# Altium schematic sheet SHT_3_EDBG_07349-R5_L10.SchDoc
size B; CompanyName: Microchip Technology Inc.; Organization: Microchip Technology; Address1: 2355 West Chandler Blvd.; Address2: Chandler, AZ  85224; Address4: USA; SheetNumber: 3; SheetTotal: 9; SheetTitle: Embedded Debugger (EDBG); Time: Time
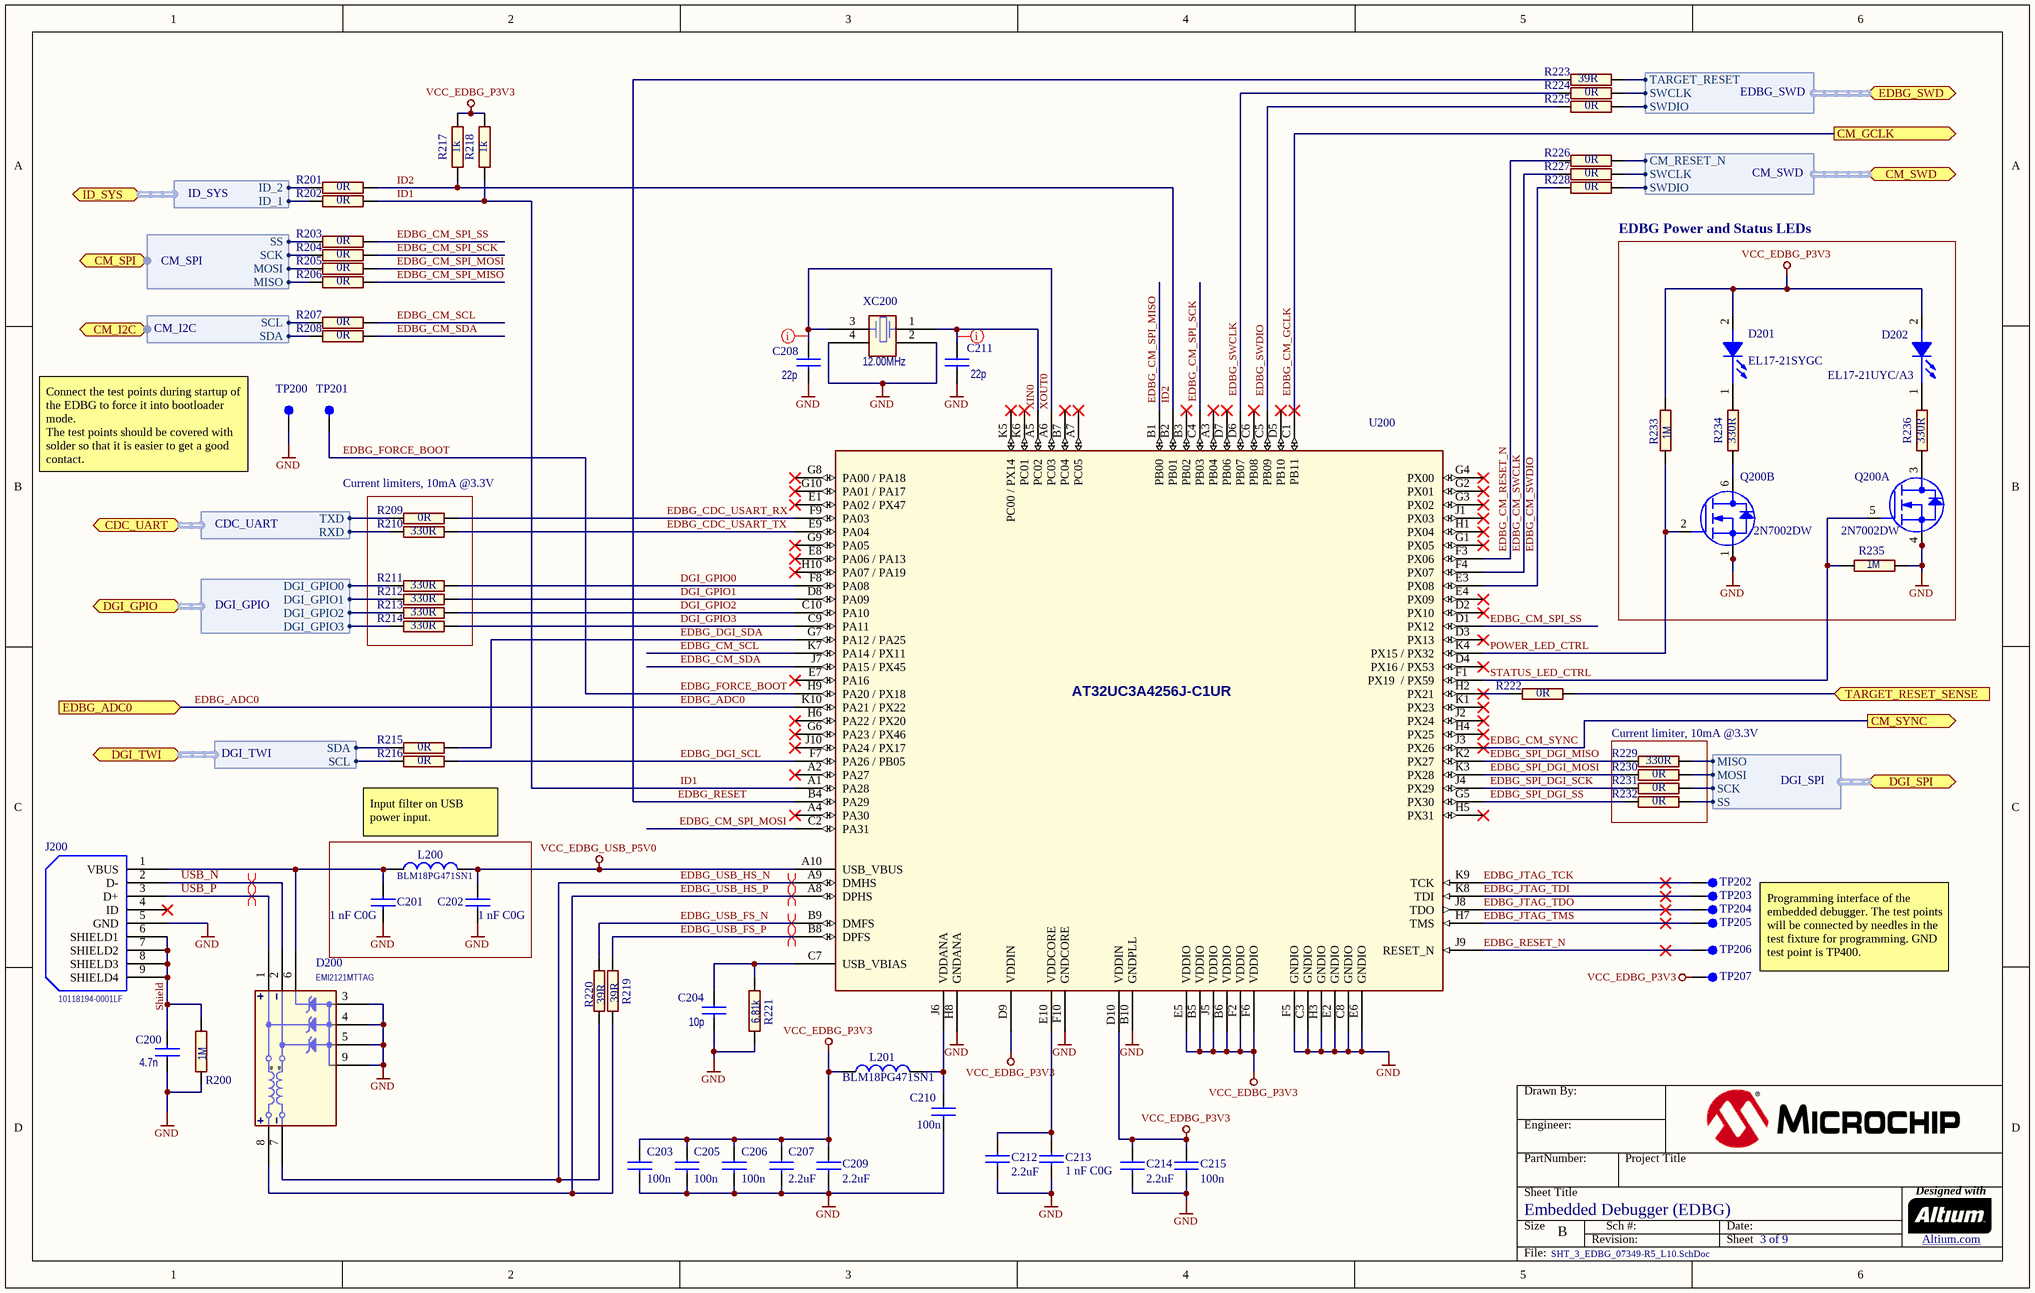
[diagram p0: SHT_3_EDBG_07349-R5_L10.SchDoc]

## Parts
?  (no value)  (graphical)
C200  value 4.7n  [AP1-00053]
C201  value 1 nF C0G  [AP1-00053]
C202  value 1 nF C0G  [AP1-00053]
C203  value 100n  [AP1-00053]
C204  value 10p  [AP1-00053]
C205  value 100n  [AP1-00053]
C206  value 100n  [AP1-00053]
C207  value 2.2uF  [AP1-00053]  (hidden comment: Farnell no: 1288200)
C208  value 22p  [AP1-00053]
C209  value 2.2uF  [AP1-00053]  (hidden comment: Farnell no: 1288200)
C210  value 100n  [AP1-00053]
C211  value 22p  [AP1-00053]
C212  value 2.2uF  [AP1-00053]  (hidden comment: Farnell no: 1288200)
C213  value 1 nF C0G  [AP1-00053]
C214  value 2.2uF  [AP1-00053]
C215  value 100n  [AP1-00053]  (hidden comment: Farnell no: 1288200)
D200  value EMI2121MTTAG  [AP4-00159]  (hidden comment: WDFN8)
D201  value EL17-21SYGC  [AP4-00013]
D202  value EL17-21UYC/A3  [AP4-00013]
J200  MPN: 10118194-0001LF  [AP8-01117]  (hidden comment: USB_AB)
L200  value BLM18PG471SN1  [AP3-00005]
L201  value BLM18PG471SN1  [AP3-00005]
Q200  value 2N7002DW  [AP5-00001]  (hidden comment: Same as 2N7002 but with two MOSFETs in one package)  (parts A,B of 2)
R200  value 1M  [AP2-00011]
R201  value 0R  [AP2-00011]
R202  value 0R  [AP2-00011]
R203  value 0R  [AP2-00011]
R204  value 0R  [AP2-00011]
R205  value 0R  [AP2-00011]
R206  value 0R  [AP2-00011]
R207  value 0R  [AP2-00011]
R208  value 0R  [AP2-00011]
R209  value 0R  [AP2-00000]
R210  value 330R  [AP2-00000]
R211  value 330R  [AP2-00000]
R212  value 330R  [AP2-00000]
R213  value 330R  [AP2-00000]
R214  value 330R  [AP2-00000]
R215  value 0R  [AP2-00000]
R216  value 0R  [AP2-00000]
R217  value 1k  [AP2-00000]
R218  value 1k  [AP2-00000]
R219  value 39R  [AP2-00011]
R220  value 39R  [AP2-00011]
R221  value 6.81k  [AP2-00011]
R222  value 0R  [AP2-00000]
R223  value 39R  [AP2-00011]
R224  value 0R  [AP2-00011]
R225  value 0R  [AP2-00011]
R226  value 0R  [AP2-00000]
R227  value 0R  [AP2-00000]
R228  value 0R  [AP2-00000]
R229  value 330R  [AP2-00000]
R230  value 0R  [AP2-00000]
R231  value 0R  [AP2-00000]
R232  value 0R  [AP2-00000]
R233  value 1M  [AP2-00011]
R234  value 330R  [AP2-00011]
R235  value 1M  [AP2-00011]
R236  value 330R  [AP2-00011]
TP200  (no value)  [AP8-00010]  (no BOM)
TP201  (no value)  [AP8-00010]  (no BOM)
TP202  (no value)  [AP8-00010]  (no BOM)
TP203  (no value)  [AP8-00010]  (no BOM)
TP204  (no value)  [AP8-00010]  (no BOM)
TP205  (no value)  [AP8-00010]  (no BOM)
TP206  (no value)  [AP8-00010]  (no BOM)
TP207  (no value)  [AP8-00010]  (no BOM)
U200  value AT32UC3A4256J-C1UR  [AP6-00206]  (hidden comment: 100 ball VFBGA)
XC200  value 12.00MHz  [AP7-00039]

## Blocks framed on the sheet
EDBG Power and Status LEDs: D201 D202 Q200 R233-R236
Current limiter, 10mA @3.3V: R229-R232

## Ports
CDC_UART (harness CDC_UART), CM_GCLK (out), CM_I2C (harness CM_I2C), CM_SPI (harness CM_SPI), CM_SWD (harness CM_SWD), CM_SYNC (out), DGI_GPIO (harness DGI_GPIO), DGI_SPI (harness DGI_SPI), DGI_TWI (harness DGI_TWI), EDBG_ADC0 (in), EDBG_SWD (harness EDBG_SWD), ID_SYS (harness ID_SYS), TARGET_RESET_SENSE (in)

## Harnesses
CDC_UART: TXD, RXD
DGI_SPI: MISO, MOSI, SCK, SS
DGI_GPIO: DGI_GPIO0, DGI_GPIO1, DGI_GPIO2, DGI_GPIO3
ID_SYS: ID_1, ID_2
DGI_TWI: SCL, SDA
CM_I2C: SCL, SDA
CM_SWD: SWCLK, SWDIO, CM_RESET_N
CM_SPI: MISO, MOSI, SCK, SS
EDBG_SWD: SWCLK, SWDIO, TARGET_RESET

## Nets
GND: C200.1 C201.2 C202.2 C203.2 C204.2 C205.2 C206.2 C207.2 C208.2 C209.2 C210.2 C211.2 C212.2 C213.2 C214.2 C215.2 D200.3(GND) D200.4(GND) D200.5(GND) D200.9(GND) J200.5(GND) Q200.1(S2) Q200.4(S1) R200.1 R221.1 R235.1 TP200.1 U200.B10(GNDPLL) U200.C3(GNDIO) U200.C8(GNDIO) U200.E2(GNDIO) U200.E6(GNDIO) U200.F5(GNDIO) U200.F10(GNDCORE) U200.H3(GNDIO) U200.H8(GNDANA) XC200.2 XC200.4
VCC_EDBG_P3V3: C203.1 C205.1 C206.1 C207.1 C209.1 C214.1 C215.1 D201.2(ANODE) D202.2(ANODE) L201.1 R217.2 R218.2 R233.2 TP207.1 U200.B5(VDDIO) U200.B6(VDDIO) U200.D9(VDDIN) U200.D10(VDDIN) U200.E5(VDDIO) U200.F2(VDDIO) U200.F6(VDDIO) U200.J5(VDDIO)
VCC_EDBG_USB_P5V0: C202.1 L200.2 U200.A10(USB_VBUS)
DGI_GPIO0: R211.2 U200.F8(PA08)
DGI_GPIO1: R212.2 U200.D8(PA09)
DGI_GPIO2: R213.2 U200.C10(PA10)
DGI_GPIO3: R214.2 U200.C9(PA11)
EDBG_ADC0: U200.K10(PA21_/_PX22) ; port EDBG_ADC0
EDBG_CDC_USART_RX: R209.1 U200.F9(PA03)
EDBG_CDC_USART_TX: R210.2 U200.E9(PA04)
EDBG_CM_GCLK: U200.C1(PB11) ; port CM_GCLK
EDBG_CM_RESET_N: R226.2 U200.F3(PX06)
EDBG_CM_SCL: R207.1 U200.K7(PA14_/_PX11)
EDBG_CM_SDA: R208.1 U200.J7(PA15_/_PX45)
EDBG_CM_SPI_MISO: R206.1 U200.B1(PB00)
EDBG_CM_SPI_MOSI: R205.1 U200.C2(PA31)
EDBG_CM_SPI_SCK: R204.1 U200.C4(PB03)
EDBG_CM_SPI_SS: R203.1 U200.D1(PX12)
EDBG_CM_SWCLK: R227.2 U200.F4(PX07)
EDBG_CM_SWDIO: R228.2 U200.E3(PX08)
EDBG_CM_SYNC: U200.J3(PX26) ; port CM_SYNC
EDBG_DGI_SCL: R216.1 U200.F7(PA26_/_PB05)
EDBG_DGI_SDA: R215.1 U200.G7(PA12_/_PA25)
EDBG_FORCE_BOOT: TP201.1 U200.H9(PA20_/_PX18)
EDBG_JTAG_TCK: TP202.1 U200.K9(TCK)
EDBG_JTAG_TDI: TP203.1 U200.K8(TDI)
EDBG_JTAG_TDO: TP204.1 U200.J8(TDO)
EDBG_JTAG_TMS: TP205.1 U200.H7(TMS)
EDBG_RESET: R223.1 U200.B4(PA29)
EDBG_RESET_N: TP206.1 U200.J9(RESET_N)
EDBG_SPI_DGI_MISO: R229.1 U200.K2(PX27)
EDBG_SPI_DGI_MOSI: R230.2 U200.K3(PX28)
EDBG_SPI_DGI_SCK: R231.2 U200.J4(PX29)
EDBG_SPI_DGI_SS: R232.2 U200.G5(PX30)
EDBG_SWCLK: R224.2 U200.D6(PB07)
EDBG_SWDIO: R225.1 U200.C5(PB09)
EDBG_USB_FS_N: R220.2 U200.B9(DMFS)
EDBG_USB_FS_P: R219.2 U200.B8(DPFS)
EDBG_USB_HS_N: D200.7(DIFF2_INT) R220.1 U200.A9(DMHS)
EDBG_USB_HS_P: D200.8(DIFF1_INT) R219.1 U200.A8(DPHS)
ID1: R202.1 R218.1 U200.A1(PA28)
ID2: R201.1 R217.1 U200.B2(PB01)
POWER_LED_CTRL: Q200.2(G2) R233.1 U200.K4(PX15_/_PX32)
Shield: C200.2 J200.6(SHIELD1) J200.7(SHIELD2) J200.8(SHIELD3) J200.9(SHIELD4) R200.2
STATUS_LED_CTRL: Q200.5(G1) R235.2 U200.F1(PX19__/_PX59)
TARGET_RESET_SENSE: R222.1 ; port TARGET_RESET_SENSE
USB_N: D200.2(DIFF2_EXT) J200.2(D-)
USB_P: D200.1(DIFF1_EXT) J200.3(D+)
XIN0: C211.1 U200.A5(PC02) XC200.1
XOUT0: C208.1 U200.A6(PC03) XC200.3
NetC201_1: C201.1 D200.6(VBUS) J200.1(VBUS) L200.1
NetC204_1: C204.1 R221.2 U200.C7(USB_VBIAS)
NetC210_1: C210.1 L201.2 U200.J6(VDDANA)
NetC212_1: C212.1 C213.1 U200.E10(VDDCORE)
NetD201_1: D201.1(CATHODE) R234.2
NetD202_1: D202.1(CATHODE) R236.2
NetQ200_3: Q200.3(D1) R236.1
NetQ200_6: Q200.6(D2) R234.1
NetR201_2: R201.2 ; port ID_SYS.ID_2
NetR202_2: R202.2 ; port ID_SYS.ID_1
NetR203_2: R203.2 ; port CM_SPI.SS
NetR204_2: R204.2 ; port CM_SPI.SCK
NetR205_2: R205.2 ; port CM_SPI.MOSI
NetR206_2: R206.2 ; port CM_SPI.MISO
NetR207_2: R207.2 ; port CM_I2C.SCL
NetR208_2: R208.2 ; port CM_I2C.SDA
NetR209_2: R209.2 ; port CDC_UART.TXD
NetR210_1: R210.1 ; port CDC_UART.RXD
NetR211_1: R211.1 ; port DGI_GPIO.DGI_GPIO0
NetR212_1: R212.1 ; port DGI_GPIO.DGI_GPIO1
NetR213_1: R213.1 ; port DGI_GPIO.DGI_GPIO2
NetR214_1: R214.1 ; port DGI_GPIO.DGI_GPIO3
NetR215_2: R215.2 ; port DGI_TWI.SDA
NetR216_2: R216.2 ; port DGI_TWI.SCL
NetR222_2: R222.2 U200.H2(PX21)
NetR223_2: R223.2 ; port EDBG_SWD.TARGET_RESET
NetR224_1: R224.1 ; port EDBG_SWD.SWCLK
NetR225_2: R225.2 ; port EDBG_SWD.SWDIO
NetR226_1: R226.1 ; port CM_SWD.CM_RESET_N
NetR227_1: R227.1 ; port CM_SWD.SWCLK
NetR228_1: R228.1 ; port CM_SWD.SWDIO
NetR229_2: R229.2 ; port DGI_SPI.MISO
NetR230_1: R230.1 ; port DGI_SPI.MOSI
NetR231_1: R231.1 ; port DGI_SPI.SCK
NetR232_1: R232.1 ; port DGI_SPI.SS

Not connected (* = marked no-connect by the designer): J200 4(ID)*; U200 A2(PA27)* A3(PB04)* A4(PA30)* A7(PC05)* B3(PB02)* B7(PC04)* C6(PB08)* D2(PX10)* D3(PX13)* D4(PX16_/_PX53)* D5(PB10)* D7(PB06)* E1(PA02_/_PX47)* E4(PX09)* E7(PA16)* E8(PA06_/_PA13)* G1(PX05)* G2(PX01)* G3(PX02)* G4(PX00)* G6(PA23_/_PX46)* G8(PA00_/_PA18)* G9(PA05)* G10(PA01_/_PA17)* H1(PX04)* H4(PX25)* H5(PX31)* H6(PA22_/_PX20)* H10(PA07_/_PA19)* J1(PX03)* J2(PX24)* J10(PA24_/_PX17)* K1(PX23)* K5(PC00_/_PX14)* K6(PC01)*

## Layout directives
differential pair; rule Assembly Testpoint Usage [Testpoint - Not Allowed    Multiple - Not Allowed]: EDBG_USB_FS_N, EDBG_USB_FS_P, EDBG_USB_HS_N, EDBG_USB_HS_P, USB_N, USB_P
rule Assembly Testpoint Usage [Testpoint - Not Allowed    Multiple - Not Allowed]: XIN0, XOUT0

## Notes on the sheet
- (near TP200) Connect the test points during startup of the EDBG to force it into bootloader mode.
  The test points should be covered with solder so that it is easier to get a good contact.
- Current limiters, 10mA @3.3V
- Input filter on USB power input.
- Programming interface of the embedded debugger. The test points will be connected by needles in the test fixture for programming. GND test point is TP400.
- Drawn By:
- Engineer:
- PartNumber:
- Project Title
- Sheet Title
- Size
- B
- Revision:
- Sch #:
- Date:
- Sheet
- Designed with
- Altium.com <http://go.altium.com/MicrochipLandingPage_Evaluation.html>
- File:

## Library data of the parts
? = Title Block B
C200 = A01-0046: Ceramic capacitor, SMD 0402, X7R, 25V, +/-10% (de35287); PartGroup: Capacitors,Ceramic,SMD 0402; Manufacturer: PHYCOMP; MPN: 2238 587 15632; TemperatureRange: -55 - +125 deg C; ComponentStatus: 'Active (verified)'; Status: Active; Verified by: Lars Helge Mo; Verified date: 2005-12-15; AN: A01-0046; Tolerance: 25V, +/-10%; Height: 0.550000011920929; FootprintStatus: 'Active (Verified)'
C201 C202 C213 = A01-0321: Ceramic capacitor, SMD 0402, C0G, 50V, +/-5%; PartGroup: Capacitors,Ceramic,SMD 0402; Manufacturer: Murata; MPN: GRM1555C1H102JA01D; Tolerance: 5%; ComponentStatus: 'Active (verified)'; Status: Active; Verified by: Lars Helge Mo; Verified date: 2005-12-15; AN: A01-0321; FootprintStatus: 'Active (Verified)'; Height: 0.550000011920929
C203 C205 C206 C210 C215 = A01-0246: Ceramic capacitor, SMD 0402, X7R, 16V, +/-10%; PartGroup: Capacitors,Ceramic,SMD 0402; Manufacturer: Kemet; MPN: C0402C104K4RACTU; TemperatureRange: -55 - +125 deg C; ComponentStatus: 'Active (verified)'; Status: Active; Verified by: Lars Helge Mo; Verified date: 2005-12-15; AN: A01-0246; Tolerance: 16V, +/-10%; Height: 0.5; FootprintStatus: 'Active (Verified)'
C204 = A01-0015: Ceramic capacitor, SMD 0402, NP0, 50V, +/-5%; PartGroup: Capacitors,Ceramic,SMD 0402; Manufacturer: AVX; MPN: 04025A100JAT2A; TemperatureRange: -55 - +125 deg C; ComponentStatus: 'Active (verified)'; Status: Active; Verified by: Lars Helge Mo; Verified date: 2005-12-15; AN: A01-0015; Tolerance: 50V, +/-5%; Height: 0.550000011920929; FootprintStatus: 'Active (Verified)'
C207 C209 C212 C214 = A01-0300: Ceramic capacitor, SMD 0402, X5R, 6.3V, +/-20%; PartGroup: Capacitors,Ceramic,SMD 0402; Manufacturer: Kemet; MPN: C0402C225M9PAC; Tolerance: Â±20%; TemperatureRange: -55Â°C to +85Â°C; ComponentStatus: 'Active (verified)'; Status: Active; Verified by: Lars Helge Mo; Verified date: 2005-12-15; AN: A01-0300; Height: 0.5; FootprintStatus: 'Active (Verified)'
C208 C211 = A01-0019: Ceramic capacitor, SMD 0402, NP0, 50V, +/-5%; PartGroup: Capacitors,Ceramic,SMD 0402; Manufacturer: YAGEO CORP; MPN: CC0402JRNPO9BN220; TemperatureRange: -55 - +125 deg C; ComponentStatus: 'Active (verified)'; Status: Active; Verified by: Lars Helge Mo; Verified date: 2005-12-15; AN: A01-0019; Tolerance: 50V, +/-5%; Height: 0.550000011920929; FootprintStatus: 'Active (Verified)'
D200 = A04-0195: EMI2121, SZEMI2121 Single Pair Common Mode Filter with ESD Protection; PartGroup: Diodes,Transient suppression; Manufacturer: ON Semiconductor; TemperatureRange: âˆ’40 to +85 Â°C; ComponentStatus: 'Active (verified)'; AN: A04-0195; Height: 0.800000011920929; MPN: EMI2121MTTAG; FootprintStatus: 'Active (Verified)'
D201 = A10-0018: LED, Green, Wave length=575nm, SMD 0805, ±70°; PartGroup: Opto,LEDs,SMD; Manufacturer: Everlight; TemperatureRange: -40 - +85 deg C; ComponentStatus: 'Active (verified)'; Verified date: 2006-02-17; Verified by: Sveinung Helgeland; Status: Active; AN: A10-0018; Height: 1.10000002384186; MPN: EL17-21SYGC; FootprintStatus: 'Active (Verified)'
D202 = A10-0019: LED, Yellow, Wave length=591nm, SMD 0805, ±70°; PartGroup: Opto,LEDs,SMD; Manufacturer: Everlight; MPN: 17-21UYC/S530-A3/TR8; TemperatureRange: -40 to +85 deg C; ComponentStatus: 'Active (verified)'; Verified date: 2006-02-17; Verified by: Sveinung Helgeland; Status: Active; AN: A10-0019; Height: 1.10000002384186; FootprintStatus: 'Active (Verified)'
J200 = A08-2885: micro B USB 2.0 Receptacle Connector 5 Position Surface Mount, Right Angle; Through Hole; PartGroup: Mechanical devices,Connectors,USB; Manufacturer: Amphenol; Value: CONN USB MICRO B RECPT SMT R/A; ComponentStatus: 'Active (verified)'; Verified date: 2006-05-18; Verified by: Eirik Rasmussen; Status: Active; AN: A08-2885; Height: 2.40000009536743; FootprintStatus: 'Active (Verified)'
L200 L201 = A03-0035: SMD RF inductor 0603. Z=470Ohm (@100MHz), Max R(dc)=0.65Ohm, Max current=1A; PartGroup: Inductors,EMI; Manufacturer: Murata; Tolerance: ±25%; TemperatureRange: -55°C to +125°C; ComponentStatus: 'Active (verified)'; Verified date: 2006-01-30; Verified by: Lars Helge Mo; Status: Active; AN: A03-0035; Height: 0.800000011920929; MPN: BLM18PG471SN1; FootprintStatus: 'Active (Verified)'
Q200 = A05-0051: Dual N-Channel MOSFET, 60V, 115mA cont,RDS(ON) < 7.5 Ohm @50mA@5V, SOT-363; PartGroup: Transistors,Small signal FET,SMD; Manufacturer: Fairchild; TemperatureRange: -65 to 150 deg C; ComponentStatus: 'Active (verified)'; Status: New; AN: A05-0051; Height: 1.10000002384186; MPN: 2N7002DW; FootprintStatus: 'Active (Verified)'
R200 = A02-0846: Thick film resistror, SMD 0402, 1/16W, 1%; PartGroup: Resistors,SMD,0402 1%; Manufacturer: YAGEO CORP; MPN: RC0402FR-071ML; TemperatureRange: -55 to +155 deg C; ComponentStatus: 'Active (verified)'; Status: Active; Verified by: Lars Helge Mo; Verified date: 2005-12-19; AN: A02-0846; Tolerance: 1%; Height: 0.349999994039536; FootprintStatus: 'Active (Verified)'
R201-R209 R215 R216 R222 R224-R228 R230-R232 = A02-0163: RES 0.0 OHM 1/16W 0402 SMD; PartGroup: Resistors,SMD,0402 1%; Manufacturer: (n/a); MPN: RMCF0402ZT0R00; Tolerance: 1 %; TemperatureRange: -55 - +125 deg C; ComponentStatus: 'Active (verified)'; Status: Active; Verified by: Lars Helge Mo; Verified date: 2005-12-19; AN: A02-0163; Height: 0.349999994039536; FootprintStatus: 'Active (Verified)'
R210-R214 R229 R234 R236 = A02-0200: Thick film resistor, SMD 0402, 1/16W, 1%; PartGroup: Resistors,SMD,0402 1%; Manufacturer: ASJ; MPN: CR10-3300-FK; TemperatureRange: -55 - +125 deg C; ComponentStatus: 'Active (verified)'; Status: Active; Verified by: Lars Helge Mo; Verified date: 2005-12-19; AN: A02-0200; Tolerance: 1 %; Height: 0.349999994039536; FootprintStatus: 'Active (Verified)'
R217 R218 = A02-0212: Thick film resistor, SMD 0402, 1/16W, 1%; PartGroup: Resistors,SMD,0402 1%; Manufacturer: ASJ; MPN: CR10-1001-FK; TemperatureRange: -55 - +125 deg C; ComponentStatus: 'Active (verified)'; Status: Active; Verified by: Lars Helge Mo; Verified date: 2005-12-19; AN: A02-0212; Tolerance: 1 %; Height: 0.349999994039536; FootprintStatus: 'Active (Verified)'
R219 R220 R223 = A02-0178: Thick film resistor, SMD 0402, 1/16W, 1%; PartGroup: Resistors,SMD,0402 1%; Manufacturer: ASJ; MPN: CR10-39R0-FK; TemperatureRange: -55 - +125 deg C; ComponentStatus: 'Active (verified)'; Status: Active; Verified by: Lars Helge Mo; Verified date: 2005-12-19; AN: A02-0178; Tolerance: 1 %; Height: 0.349999994039536; FootprintStatus: 'Active (Verified)'
R221 = A02-0539: Thick film resistor, SMD 0402, 1/16W, 1%; PartGroup: Resistors,SMD,0402 1%; Manufacturer: vishay; MPN: CRCW04026K81FKED; TemperatureRange: -55 - +125 deg C; ComponentStatus: 'Active (verified)'; Status: Active; Verified by: Lars Helge Mo; Verified date: 2005-12-19; AN: A02-0539; Tolerance: 1%; Height: 0.349999994039536; FootprintStatus: 'Active (Verified)'
R233 R235 = A02-0846: Thick film resistror, SMD 0402, 1/16W, 1%; PartGroup: Resistors,SMD,0402 1%; Manufacturer: YAGEO CORP; MPN: RC0402FR-071ML; TemperatureRange: -55 to +155 deg C; ComponentStatus: 'Active (verified)'; Placement: YES; Status: Active; Verified by: Lars Helge Mo; Verified date: 2005-12-19; AN: A02-0846; Tolerance: 1%; Height: 0.349999994039536; FootprintStatus: 'Active (Verified)'
TP200-TP207 = A08-0004: Single SMD testpad; PartGroup: Mechanical devices,Connectors,Test points; ComponentStatus: 'Active (verified)'; Status: Active; Verified by: Sveinung Helgeland; Verified date: 2006-02-17; AN: A08-0004; Value: TESTPAD; Height: 0; FootprintStatus: 'Active (Verified)'
U200 = A06-0736: EDBG controller; PartGroup: Integrated Circuits,MCU, MPU, DSP,AVR MCU; Manufacturer: ATMEL; TemperatureRange: -40 to +85 deg C; ComponentStatus: 'Active (verified)'; Status: Not verified; AN: A06-0736; Height: 1; MPN: AT32UC3A4256J-C1UR; FootprintStatus: 'Active (Verified)'
XC200 = A07-0042: Fox FQ5032B 12.0000MHz  20pF SMD crystal 738B-12; PartGroup: Frequency devices,Crystals,SMD; Manufacturer: Fox  Electronics; MPN: FQ5032B-12.000; Tolerance: Â±30ppm; TemperatureRange: 0Â°C ~ 70Â°C; ComponentStatus: 'Active (verified)'; Status: Active; Verified by: Ketil Skjerve; Verified date: 2007-06-15; AN: A07-0042; Height: 1.20000004768372; FootprintStatus: 'Active (Verified)'